# Altium schematic sheet Monitor-Protection_48V.SchDoc: None
size A2; CompanyName: swissEmbedded GmbH; DrawnBy: Daniel Haensse; Engineer: Daniel Haensse; Organization: swissEmbedded GmbH; Address1: Landstrasse 18; Address2: 5415 Rieden; Address3: Switzerland; Address4: info@swissembedded.com; Revision: A; SheetNumber: 1; SheetTotal: 1
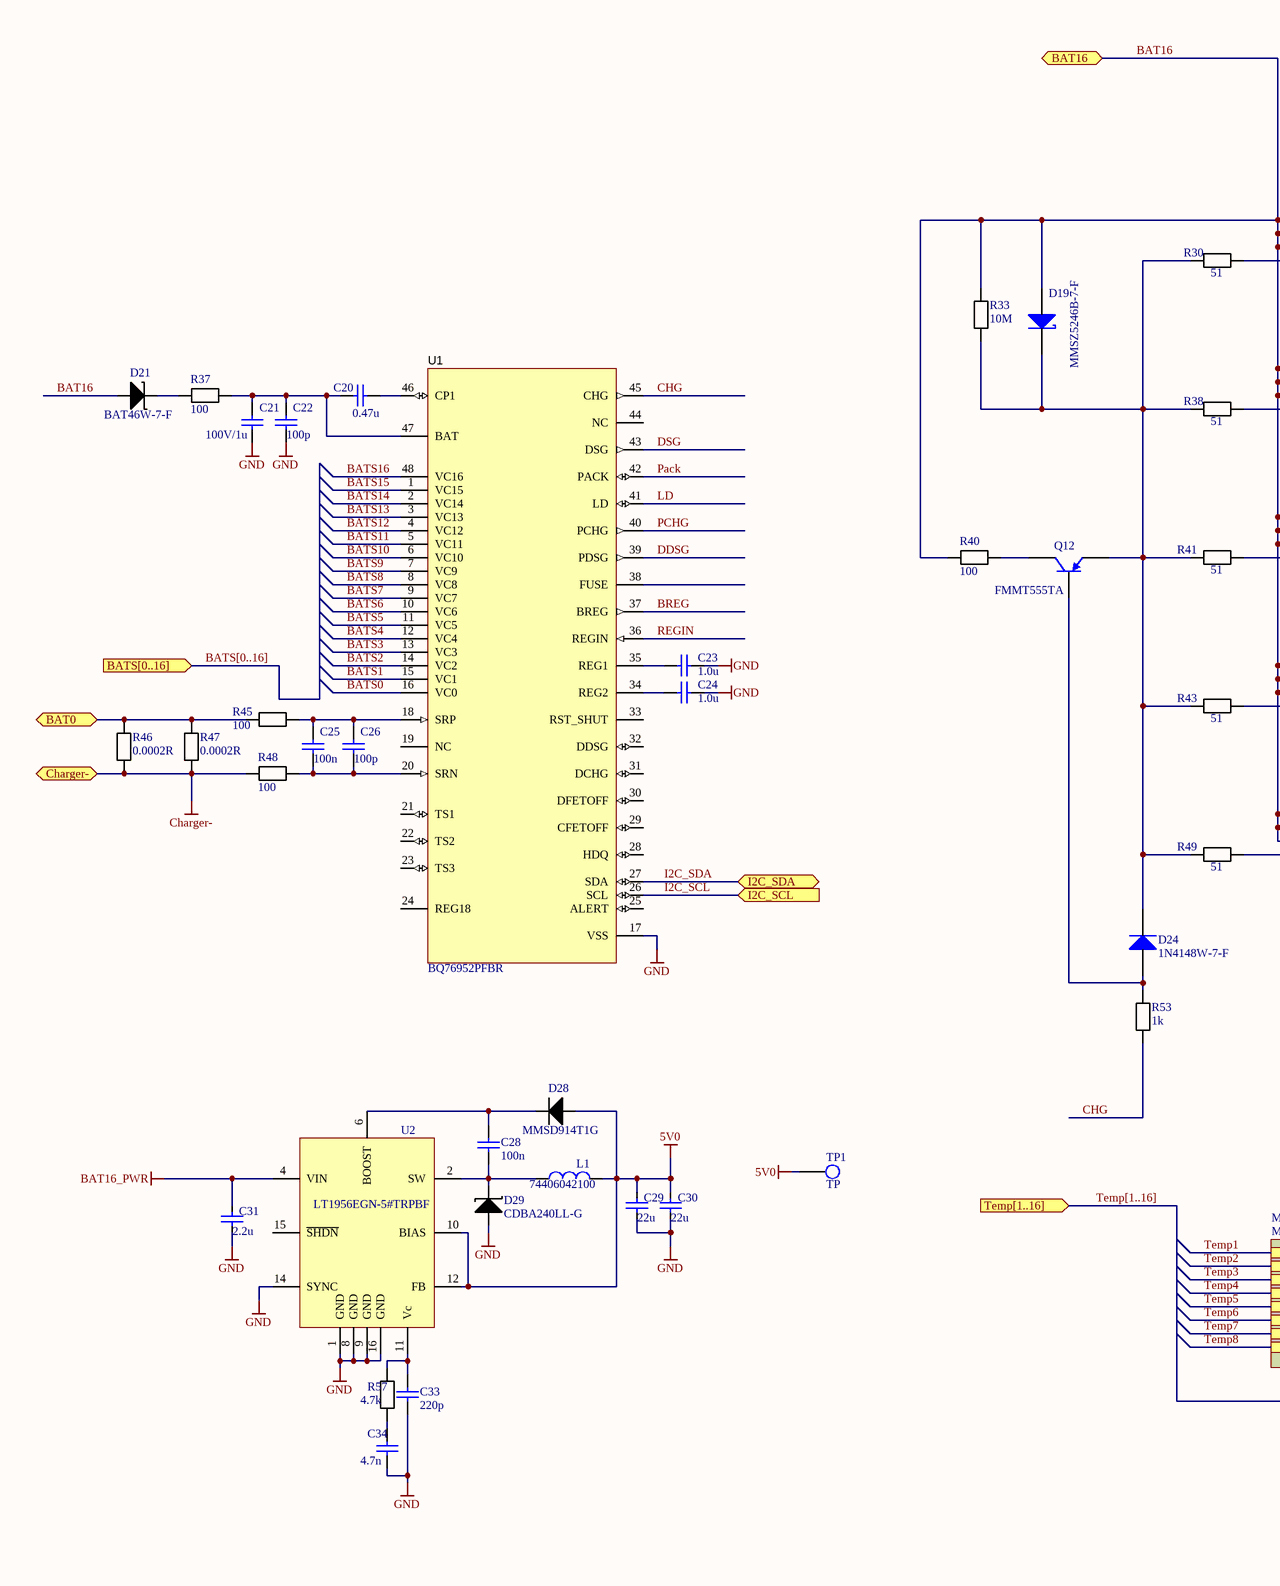
[diagram p0: Monitor-Protection_48V.SchDoc, left]
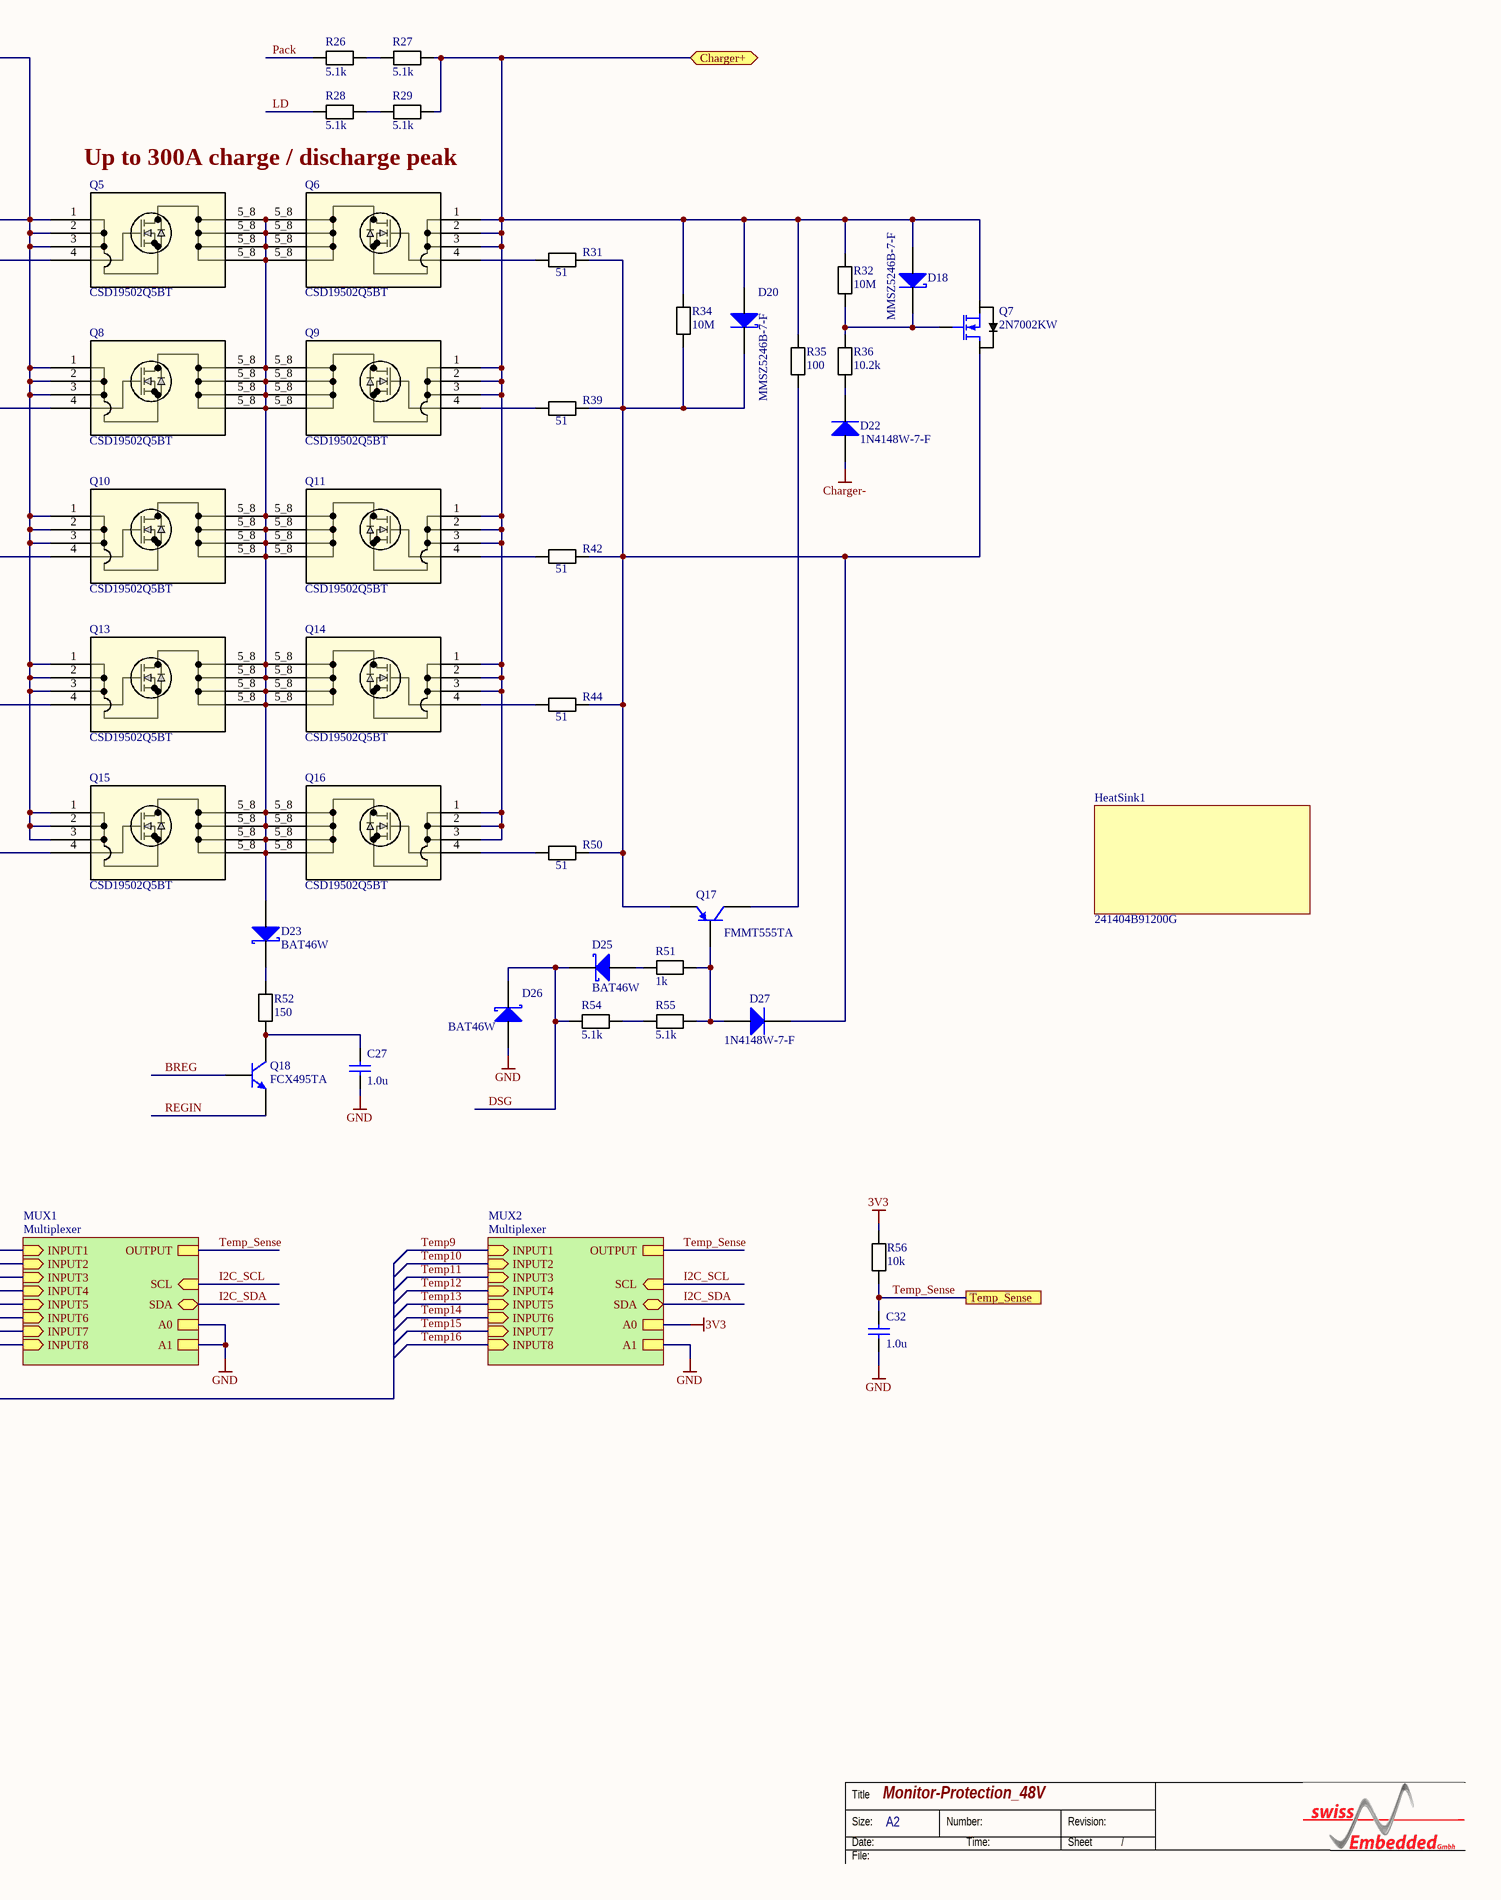
[diagram p1: Monitor-Protection_48V.SchDoc, right]

## Parts
C20  0.47u  [C0805]
C21  100V/1u  [C1206]
C22  100p  [C0603]
C23  1.0u  [C0603]
C24  1.0u  [C0603]
C25  100n  [C0603]
C26  100p  [C0603]
C27  1.0u  [C0603]
C28  100n  [C0603]
C29  22u  [C1210]
C30  22u  [C1210]
C31  2.2u  [C1210]
C32  1.0u  [C0603]
C33  220p  [C0603]
C34  4.7n  [C0603]
D18  MMSZ5246B-7-F  [SOD-323]
D19  MMSZ5246B-7-F  [SOD-323]
D20  MMSZ5246B-7-F  [SOD-323]
D21  BAT46W-7-F  [SOD123]
D22  1N4148W-7-F  [SOD123]
D23  BAT46W  [SOD123]
D24  1N4148W-7-F  [SOD123]
D25  BAT46W  [SOD123]
D26  BAT46W  [SOD123]
D27  1N4148W-7-F  [SOD123]
D28  MMSD914T1G  [SOD123]
D29  CDBA240LL-G  [DO-214AC]
HeatSink1  241404B91200G  [HeatSink_241404B91200G]  (no BOM)
L1  74406042100  [WURTH_74406042100]
Q5  CSD19502Q5BT  [TRANS_CSD19502Q5BT]
Q6  CSD19502Q5BT  [TRANS_CSD19502Q5BT]
Q7  2N7002KW  [SOT-323]
Q8  CSD19502Q5BT  [TRANS_CSD19502Q5BT]
Q9  CSD19502Q5BT  [TRANS_CSD19502Q5BT]
Q10  CSD19502Q5BT  [TRANS_CSD19502Q5BT]
Q11  CSD19502Q5BT  [TRANS_CSD19502Q5BT]
Q12  FMMT555TA  [SOT23-3N]
Q13  CSD19502Q5BT  [TRANS_CSD19502Q5BT]
Q14  CSD19502Q5BT  [TRANS_CSD19502Q5BT]
Q15  CSD19502Q5BT  [TRANS_CSD19502Q5BT]
Q16  CSD19502Q5BT  [TRANS_CSD19502Q5BT]
Q17  FMMT555TA  [SOT23-3N]
Q18  FCX495TA  [SOT-89]
R26  5.1k  [R0603]
R27  5.1k  [R0603]
R28  5.1k  [R0603]
R29  5.1k  [R0603]
R30  51  [R0603]
R31  51  [R0603]
R32  10M  [R0603]
R33  10M  [R0603]
R34  10M  [R0603]
R35  100  [R0603]
R36  10.2k  [R0603]
R37  100  [R0603]
R38  51  [R0603]
R39  51  [R0603]
R40  100  [R0603]
R41  51  [R0603]
R42  51  [R0603]
R43  51  [R0603]
R44  51  [R0603]
R45  100  [R0603]
R46  0.0002R  [RES 3920]
R47  0.0002R  [RES 3920]
R48  100  [R0603]
R49  51  [R0603]
R50  51  [R0603]
R51  1k  [R0603]
R52  150  [R0603]
R53  1k  [R0603]
R54  5.1k  [R0603]
R55  5.1k  [R0603]
R56  10k  [R0603]
R57  4.7k  [R0603]
TP1  TP  [TP]
U1  BQ76952PFBR  [QFP50P900X900X120-48N]
U2  LT1956EGN-5#TRPBF  [SSOP-16_GN]

## Sub-sheets
MUX1 = Multiplexer: INPUT1 (in), INPUT2 (in), INPUT3 (in), INPUT4 (in), INPUT5 (in), INPUT6 (in), INPUT7 (in), INPUT8 (in), OUTPUT, SCL (in), SDA (bidir), A0, A1
MUX2 = Multiplexer: INPUT1 (in), INPUT2 (in), INPUT3 (in), INPUT4 (in), INPUT5 (in), INPUT6 (in), INPUT7 (in), INPUT8 (in), OUTPUT, SCL (in), SDA (bidir), A0, A1

## Ports
BAT0 (bidir), BAT16 (bidir), BATS[0..16] (in), Charger+ (bidir), Charger- (bidir), I2C_SCL (in), I2C_SDA (bidir), Temp[1..16] (in), Temp_Sense

## Nets
3V3: R56.2 ; sheet MUX2/A0
5V0: C29.1 C30.1 D28.A L1.2 TP1.1(TCT) U2.10(BIAS) U2.12(FB)
BAT16_PWR: C31.1 U2.4(VIN)
Charger-: D22.A(ANODE) R46.1 R47.1 R48.1 ; port Charger-
GND: C21.1 C22.1 C23.1 C24.1 C27.2 C29.2 C30.2 C31.2 C32.2 C33.1 C34.1 D26.A(ANODE) D29.A U1.17(VSS) U2.1(GND) U2.8(GND) U2.9(GND) U2.14(SYNC) U2.16(GND) ; sheet MUX1/A0, sheet MUX1/A1, sheet MUX2/A1
BAT0: R45.1 R46.2 R47.2 ; port BAT0
BAT16: D19.A(ANODE) D21.A Q5.1(S) Q5.2(S) Q5.3(S) Q8.1(S) Q8.2(S) Q8.3(S) Q10.1(S) Q10.2(S) Q10.3(S) Q13.1(S) Q13.2(S) Q13.3(S) Q15.1(S) Q15.2(S) Q15.3(S) R33.2 R40.1 ; port BAT16
BATS0: U1.16(VC0)
BATS1: U1.15(VC1)
BATS2: U1.14(VC2)
BATS3: U1.13(VC3)
BATS4: U1.12(VC4)
BATS5: U1.11(VC5)
BATS6: U1.10(VC6)
BATS7: U1.9(VC7)
BATS8: U1.8(VC8)
BATS9: U1.7(VC9)
BATS10: U1.6(VC10)
BATS11: U1.5(VC11)
BATS12: U1.4(VC12)
BATS13: U1.3(VC13)
BATS14: U1.2(VC14)
BATS15: U1.1(VC15)
BATS16: U1.48(VC16)
BREG: Q18.1(B) U1.37(BREG)
Charger+: D18.A(ANODE) D20.A(ANODE) Q6.1(S) Q6.2(S) Q6.3(S) Q7.2(S) Q9.1(S) Q9.2(S) Q9.3(S) Q11.1(S) Q11.2(S) Q11.3(S) Q14.1(S) Q14.2(S) Q14.3(S) Q16.1(S) Q16.2(S) Q16.3(S) R27.1 R29.1 R32.2 R34.2 R35.2 ; port Charger+
CHG: R53.1 U1.45(CHG)
DDSG: U1.39(PDSG)
DSG: D25.C(CATHODE) D26.C(CATHODE) R54.1 U1.43(DSG)
I2C_SCL: U1.26(SCL) ; port I2C_SCL, sheet MUX1/SCL, sheet MUX2/SCL
I2C_SDA: U1.27(SDA) ; port I2C_SDA, sheet MUX1/SDA, sheet MUX2/SDA
LD: R28.2 U1.41(LD)
Pack: R26.2 U1.42(PACK)
PCHG: U1.40(PCHG)
REGIN: Q18.3(E) U1.36(REGIN)
Temp1: sheet MUX1/INPUT1
Temp2: sheet MUX1/INPUT2
Temp3: sheet MUX1/INPUT3
Temp4: sheet MUX1/INPUT4
Temp5: sheet MUX1/INPUT5
Temp6: sheet MUX1/INPUT6
Temp7: sheet MUX1/INPUT7
Temp8: sheet MUX1/INPUT8
Temp9: sheet MUX2/INPUT1
Temp10: sheet MUX2/INPUT2
Temp11: sheet MUX2/INPUT3
Temp12: sheet MUX2/INPUT4
Temp13: sheet MUX2/INPUT5
Temp14: sheet MUX2/INPUT6
Temp15: sheet MUX2/INPUT7
Temp16: sheet MUX2/INPUT8
Temp_Sense: C32.1 R56.1 ; port Temp_Sense, sheet MUX1/OUTPUT, sheet MUX2/OUTPUT
NetC20_1: C20.1 U1.46(CP1)
NetC20_2: C20.2 C21.2 C22.2 R37.2 U1.47(BAT)
NetC23_2: C23.2 U1.35(REG1)
NetC24_2: C24.2 U1.34(REG2)
NetC25_1: C25.1 C26.1 R48.2 U1.20(SRN)
NetC25_2: C25.2 C26.2 R45.2 U1.18(SRP)
NetC27_1: C27.1 Q18.2(C) R52.1
NetC28_1: C28.1 D29.C L1.1 U2.2(SW)
NetC28_2: C28.2 D28.C U2.6(BOOST)
NetC33_2: C33.2 R57.2 U2.11(Vc)
NetC34_2: C34.2 R57.1
NetD18_C: D18.C(CATHODE) Q7.1(G) R32.1 R36.2
NetD19_C: D19.C(CATHODE) D24.C(CATHODE) Q12.2(E) R30.1 R33.1 R38.1 R41.1 R43.1 R49.1
NetD20_C: D20.C(CATHODE) D27.C(CATHODE) Q7.3(D) Q17.2(E) R31.2 R34.1 R39.2 R42.2 R44.2 R50.2
NetD21_C: D21.C R37.1
NetD22_C: D22.C(CATHODE) R36.1
NetD23_A: D23.A(ANODE) Q5.5_8(D) Q6.5_8(D) Q8.5_8(D) Q9.5_8(D) Q10.5_8(D) Q11.5_8(D) Q13.5_8(D) Q14.5_8(D) Q15.5_8(D) Q16.5_8(D)
NetD23_C: D23.C(CATHODE) R52.2
NetD24_A: D24.A(ANODE) Q12.1(B) R53.2
NetD25_A: D25.A(ANODE) R51.2
NetD27_A: D27.A(ANODE) Q17.1(B) R51.1 R55.2
NetQ5_4: Q5.4(G) R30.2
NetQ6_4: Q6.4(G) R31.1
NetQ8_4: Q8.4(G) R38.2
NetQ9_4: Q9.4(G) R39.1
NetQ10_4: Q10.4(G) R41.2
NetQ11_4: Q11.4(G) R42.1
NetQ12_3: Q12.3(C) R40.2
NetQ13_4: Q13.4(G) R43.2
NetQ14_4: Q14.4(G) R44.1
NetQ15_4: Q15.4(G) R49.2
NetQ16_4: Q16.4(G) R50.1
NetQ17_3: Q17.3(C) R35.1
NetR26_1: R26.1 R27.2
NetR28_1: R28.1 R29.2
NetR54_2: R54.2 R55.1

Not connected (* = marked no-connect by the designer): U1 19(NC) 21(TS1) 22(TS2) 23(TS3) 24(REG18) 25(ALERT) 28(HDQ) 29(CFETOFF) 30(DFETOFF) 31(DCHG) 32(DDSG) 33(RST_SHUT) 38(FUSE) 44(NC); U2 15(~{SHDN})

## Buses and harness runs
bus BATS[0..16] = port BATS[0..16]
bus Temp[1..16] = port Temp[1..16]

## Notes on the sheet
- Up to 300A charge / discharge peak
- Title
- Size:
- Date:
- File:
- Monitor-Protection_48V
- A2
- Number:
- Time:
- Revision:
- Sheet
- /

## Library data of the parts
C20 = CAP: CAP CER 0.47UF 25V X7R 0805; Manufacturer: Yageo; Manufacturer Part Number: CC0805KKX7R8BB474; Supplier: Mouser; Supplier Part Number: 603-CC0805KKX7R8BB474; Price: 0.21; Value: 0.47u
C21 = CC1206KKX7R0BB105: Capacitor 1u 1206 +-10% 100V; Manufacturer: Yageo; Value: 100V/1u; Manufacturer Part Number: CC1206KKX7R0BB105; Price: 0.45; Supplier: Mouser; Supplier Part Number: 603-CC1206KKX7R0BB105
C22 C26 = CAP: CAP CER 100PF 100V C0G/NP0 0603; Manufacturer: Murata Electronics; Manufacturer Part Number: GCM1885C2A101FA16D; Supplier: Mouser; Supplier Part Number: 81-GCM1885C2A101FA6D; Price: 0.16; Value: 100p
C23 C24 C27 C32 = CAP: CAP CER 1UF 25V X5R 0603; Manufacturer: Yageo; Manufacturer Part Number: CC0603KRX5R8BB105; Supplier: Mouser; Supplier Part Number: 603-CC603KRX5R8BB105; Price: 0.1; Value: 1.0u
C25 C28 = CAP_YAG_CC0603KRX7R9BB104_X7R: Capacitor 100n 0603 +-10% 50V; Manufacturer: Yageo; Type: X7R; Voltage (V): 50; Part Number: CAP_YAG_CC0603KRX7R9BB104_X7R; Manufacturer Part Number: CC0603KRX7R9BB104; Category: Capacitor; Package / Case: 0603; Capacitor (Farad): 100n; Tolerance: +-10%; Thickness (mm): 0.8; Value: 100n; Supplier: Mouser; Supplier Part Number: 603-CC0603KRX7R9BB104; Price: 0.1
C29 C30 = Cap: 22µF ±10% 10V; Manufacturer: Murata; Manufacturer Part Number: GRM32ER71A226KE20L; Supplier: Digi-Key; Supplier Part Number: 490-1876-1-ND; Vaule: 22u; Price: 1.03
C31 = Cap: 2.2µF ±10% 100V; Manufacturer: Murata; Manufacturer Part Number: GRM32ER72A225KA35K; Supplier: Digi-Key; Supplier Part Number: 490-6545-1-ND; Vaule: 2.2u
C33 = CAP_YAG_CC0603KRNPO9BN221_NPO: Capacitor 220p 0603 +-10% 50V; Manufacturer: Yageo; Type: NPO; Voltage (V): 50; Part Number: CAP_YAG_CC0603KRNPO9BN221_NPO; Manufacturer Part Number: CC0603KRNPO9BN221; Category: Capacitor; Package / Case: 0603; Capacitor (Farad): 220p; Tolerance: +-10%; Thickness (mm): 0.8; Value: 220p
C34 = CAP_YAG_CC0603KRX7R9BB472_X7R: Capacitor 4.7n 0603 +-10% 50V; Manufacturer: Yageo; Type: X7R; Voltage (V): 50; Part Number: CAP_YAG_CC0603KRX7R9BB472_X7R; Manufacturer Part Number: CC0603KRX7R9BB472; Category: Capacitor; Package / Case: 0603; Capacitor (Farad): 4.7n; Tolerance: +-10%; Thickness (mm): 0.8; Value: 4.7n
D18-D20 = VD_SMD_MMSZ5246B-7-F: Diode, Zener, 16 V, 500 mW, SOD-323; Manufacturer: Diodes; Tolerance: +-5%; Temperature Coefficient: +-200ppm°C; Part Number: MMSZ5246B-7-F; Manufacturer Part Number: MMSZ5246B-7-F; Category: Diode; Package / Case: SMD; Operating Temperature: -55°C to +155°C; Value: MMSZ5246B-7-F
D21 = BAT46W-7-F: DIODE SCHOTTKY 100V 150MA SOD123; Manufacturer: Diodes Incorporated; Manufacturer Part Number: BAT46W-7-F; Value: BAT46W-7-F; Supplier: Mouser; Supplier Part Number: 621-BAT46W-7-F; Price: 0.41
D22 D24 D27 = VD_SMD_1N4148: Diode, Ultrafast, 100 V, 0.15 A, SOD-123; Manufacturer: Diodes Inc.; Manufacturer Part Number: 1N4148; Tolerance: +-5%; Temperature Coefficient: +-200ppm°C; Part Number: 1N4148W-7-F; Category: Diode; Package / Case: SMD; Operating Temperature: -55°C to +155°C; Value: 1N4148W-7-F
D23 D25 D26 = VD_SMD_BAT46W: Diode, Schottky, 100 V, 0.15 A, SOD-123; Manufacturer: CENTRAL SEMI; Manufacturer Part Number: CMMSH2-40 TR; Tolerance: +-5%; Temperature Coefficient: +-200ppm°C; Part Number: BAT46W; Category: Diode; Package / Case: SMD; Operating Temperature: -55°C to +155°C; Value: BAT46W
D28 = MMSD914T1G: DIODE GEN PURP 100V 200MA SOD123; Manufacturer: ON Semiconductor; Manufacturer Part Number: MMSD914T1G; Price: 0.2; Supplier: Digi-Key; Supplier Part Number: MMSD914T1GOSCT-ND; Value: MMSD914T1G
D29 = CDBA240LL-G: DIODE SCHOTTKY 40V 2A DO214AC; Manufacturer: Comchip Technology; Manufacturer Part Number: CDBA240LL-G; Value: CDBA240LL-G; Price: 0.58; Supplier: Digi-Key; Supplier Part Number: 641-1532-1-ND
HeatSink1 = HeatSink: Heat Sinks Heat Sink for Quarter Brick DC/DC Converters, Lengthwise Fins, 11.4mm Height; Manufacturer: Aavid; Value: 241404B91200G; Manufacturer Part Number: 241404B91200G
L1 = Inductor: FIXED IND 10UH 1.61A 133MOHM SMD; Manufacturer: Würth Elektronik; Manufacturer Part Number: 74406042100; Value: 74406042100; Supplier: Digi-Key; Supplier Part Number: 732-10810-1-ND; Price: 0.91
Q5 Q6 Q8-Q11 Q13-Q16 = VT_FET_CSD19532Q5B: MOSFET N-Channel, 3.4mOhm 80V; Manufacturer: TI; Tolerance: +-5%; Temperature Coefficient: +-200ppm°C; Manufacturer Part Number: CSD19502Q5BT; Category: FET; Package / Case: POWERPAK-SO8; Operating Temperature: -55°C to +155°C; Value: CSD19502Q5BT
Q7 = VT_FET_2N7002KW: MOSFET, N-CH, 60 V, 0.31 A, SOT-323; Manufacturer: Fairchild; Manufacturer Part Number: 2N7002KW; ComponentLink1URL: https://www.diodes.com/assets/Datasheets/ds30368.pdf; ComponentLink1Description: https://www.diodes.com/assets/Datasheets/ds30368.pdf; Value: 2N7002KW
Q12 Q17 = FMMT555TA: TRANS PNP 150V 1A SOT23-3; Manufacturer: Diodes; Supplier Part Number: FMMT555TACT-ND; Supplier: Digi-Key; Value: FMMT555TA; Manufacturer Part Number: FMMT555TA; Price: 0.46
Q18 = FCX495TA: Transistor, NPN, 150 V, 1 A, AEC-Q101, SOT-89; Manufacturer: Diodes; ComponentLink1URL: http://www.nxp.com/documents/data_sheet/BC817_BC817W_BC337.pdf; ComponentLink1Description: http://www.nxp.com/documents/data_sheet/BC817_BC817W_BC337.pdf; Value: FCX495TA; Manufacturer Part Number: FCX495TA
R26-R29 R54 R55 = RES_YAG_RC0603FR-075K1L: Resistor 5.1k 0603 +-1% 0.1; Manufacturer: Yageo; Temperature Coefficient: +-200ppm°C; Power (Watts): 0.1; Voltage (V): 75; Value: 5.1k; Part Number: RES_YAG_RC0603FR-075K1L; Manufacturer Part Number: RC0603FR-075K1L; Category: Resistor; Package / Case: 0603; Resistor (Ohms): 5.1k; Tolerance: +-1%; Operating Temperature: -55°C to +155°C; Thickness (mm): 0.45
R30 R31 R38 R39 R41-R44 R49 R50 = RES_YAG_RC0603FR-0751RL: Resistor 51 0603 +-1% 0.1; Manufacturer: Yageo; Temperature Coefficient: +-200ppm°C; Power (Watts): 0.1; Voltage (V): 75; Part Number: RES_YAG_RC0603FR-0751RL; Manufacturer Part Number: RC0603FR-0751RL; Category: Resistor; Package / Case: 0603; Resistor (Ohms): 51; Tolerance: +-1%; Operating Temperature: -55°C to +155°C; Thickness (mm): 0.45; Value: 51
R32-R34 = RES_YAG_RC0603FR-0710ML: Resistor 10M 0603 +-1% 0.1; Manufacturer: Yageo; Temperature Coefficient: +-200ppm°C; Power (Watts): 0.1; Voltage (V): 75; Value: 10M; Part Number: RES_YAG_RC0603FR-0710ML; Manufacturer Part Number: RC0603FR-0710ML; Category: Resistor; Package / Case: 0603; Resistor (Ohms): 10M; Tolerance: +-1%; Operating Temperature: -55°C to +155°C; Thickness (mm): 0.45
R35 R37 R40 R45 R48 = RES_YAG_RC0603FR-07100RL: Resistor 100 0603 +-1% 0.1; Manufacturer: Yageo; Temperature Coefficient: +-200ppm°C; Power (Watts): 0.1; Voltage (V): 75; Part Number: RES_YAG_RC0603FR-07100RL; Manufacturer Part Number: RC0603FR-07100RL; Category: Resistor; Package / Case: 0603; Resistor (Ohms): 100; Tolerance: +-1%; Operating Temperature: -55°C to +155°C; Thickness (mm): 0.45; Value: 100
  R37: Price: 0.1; Supplier: Mouser; Supplier Part Number: 603-RC0603FR-07100RL
R36 = RES_YAG_RC0603FR-0710K2L: Resistor 10.2k 0603 +-1% 0.1; Manufacturer: Yageo; Temperature Coefficient: +-200ppm°C; Power (Watts): 0.1; Voltage (V): 75; Value: 10.2k; Part Number: RES_YAG_RC0603FR-0710K2L; Manufacturer Part Number: RC0603FR-0710K2L; Category: Resistor; Package / Case: 0603; Resistor (Ohms): 10.2k; Tolerance: +-1%; Operating Temperature: -55°C to +155°C; Thickness (mm): 0.45
R46 R47 = RES: RES 0.0002 OHM 1% 12W 3920; Manufacturer: Bourns Inc.; Manufacturer Part Number: CSS2H-3920R-L200FE; Supplier: Mouser; Supplier Part Number: CSS2H-3920R-L200FE; Price: 2.03; Value: 0.0002R
R51 R53 = RES_YAG_RC0603FR-071KL: Resistor 1k 0603 +-1% 0.1; Manufacturer: Yageo; Temperature Coefficient: +-200ppm°C; Power (Watts): 0.1; Voltage (V): 75; Part Number: RES_YAG_RC0603FR-071KL; Manufacturer Part Number: RC0603FR-071KL; Category: Resistor; Package / Case: 0603; Resistor (Ohms): 1k; Tolerance: +-1%; Operating Temperature: -55°C to +155°C; Thickness (mm): 0.45; Value: 1k
R52 = RES_YAG_RC0603FR-07150RL: Resistor 150 0603 +-1% 0.1; Manufacturer: Yageo; Temperature Coefficient: +-200ppm°C; Power (Watts): 0.1; Voltage (V): 75; Value: 150; Part Number: RES_YAG_RC0603FR-07150RL; Manufacturer Part Number: RC0603FR-07150RL; Category: Resistor; Package / Case: 0603; Resistor (Ohms): 150; Tolerance: +-1%; Operating Temperature: -55°C to +155°C; Thickness (mm): 0.45
R56 = RES_YAG_RC0603FR-0710KL: Resistor 10k 0603 +-1% 0.1; Manufacturer: Yageo; Temperature Coefficient: +-200ppm°C; Power (Watts): 0.1; Voltage (V): 75; Part Number: RES_YAG_RC0603FR-0710KL; Manufacturer Part Number: RC0603FR-0710KL; Category: Resistor; Package / Case: 0603; Resistor (Ohms): 10k; Tolerance: +-1%; Operating Temperature: -55°C to +155°C; Thickness (mm): 0.45; Value: 10k
R57 = RES_YAG_RC0603FR-074K7L: Resistor 4.7k 0603 +-1% 0.1; Manufacturer: Yageo; Temperature Coefficient: +-200ppm°C; Power (Watts): 0.1; Voltage (V): 75; Part Number: RES_YAG_RC0603FR-074K7L; Manufacturer Part Number: RC0603FR-074K7L; Category: Resistor; Package / Case: 0603; Resistor (Ohms): 4.7k; Tolerance: +-1%; Operating Temperature: -55°C to +155°C; Thickness (mm): 0.45; Value: 4.7k
TP1 = TP: Testpoint; Manufacturer: None; Manufacturer Part Number: Testpads, do not populate; Value: TP
U1 = BQ76952PFBR: Multicell Battery Monitor and Protection Family, Texas Instrument BQ76952PFBR; Manufacturer: Texas Instruments; ComponentLink1URL: http://www.ti.com/lit/ds/symlink/bq76952.pdf; ComponentLink3URL: http://www.ti.com/product/bq76952/datasheet; ComponentLink3Description: Online Datasheet; ComponentLink1Description: Datasheet Link; ComponentLink2Description: Product Folder; ComponentLink2URL: http://www.ti.com/product/bq76952; Value: BQ76952PFBR; Manufacturer Part Number: BQ76952PFBR; Supplier: Mouser; Supplier Part Number: 595-BQ76952PFBR; Price: 5
U2 = LT1956EGN-5#TRPBF: IC REG BUCK 5V 1.5A 16SSOP; Manufacturer: Analog Devices Inc.; Manufacturer Part Number: LT1956EGN-5#TRPBF; value: LT1956EGN-5#TRPBF; Price: 8.88; Supplier: Digi-Key; Supplier Part Number: LT1956EGN-5#TRPBFCT-ND